# Altium schematic sheet Sheet1.SchDoc
size 1651 x 1651 mm
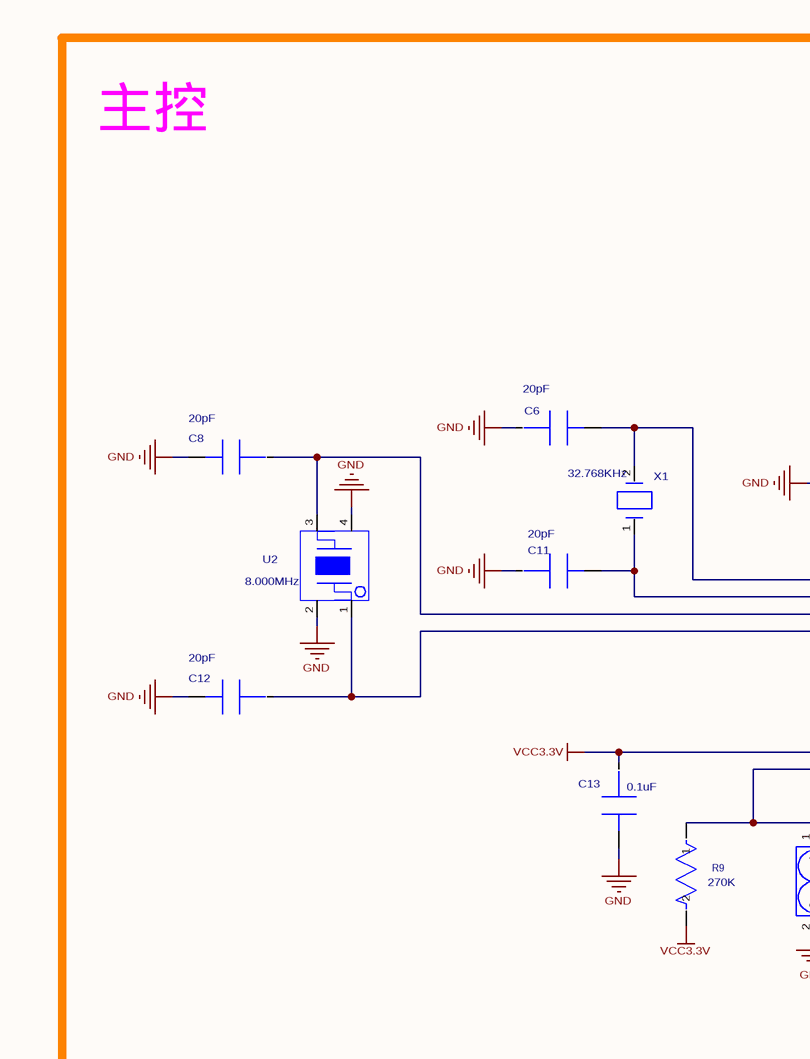
[diagram p0: Sheet1.SchDoc, top column 1 of 4]
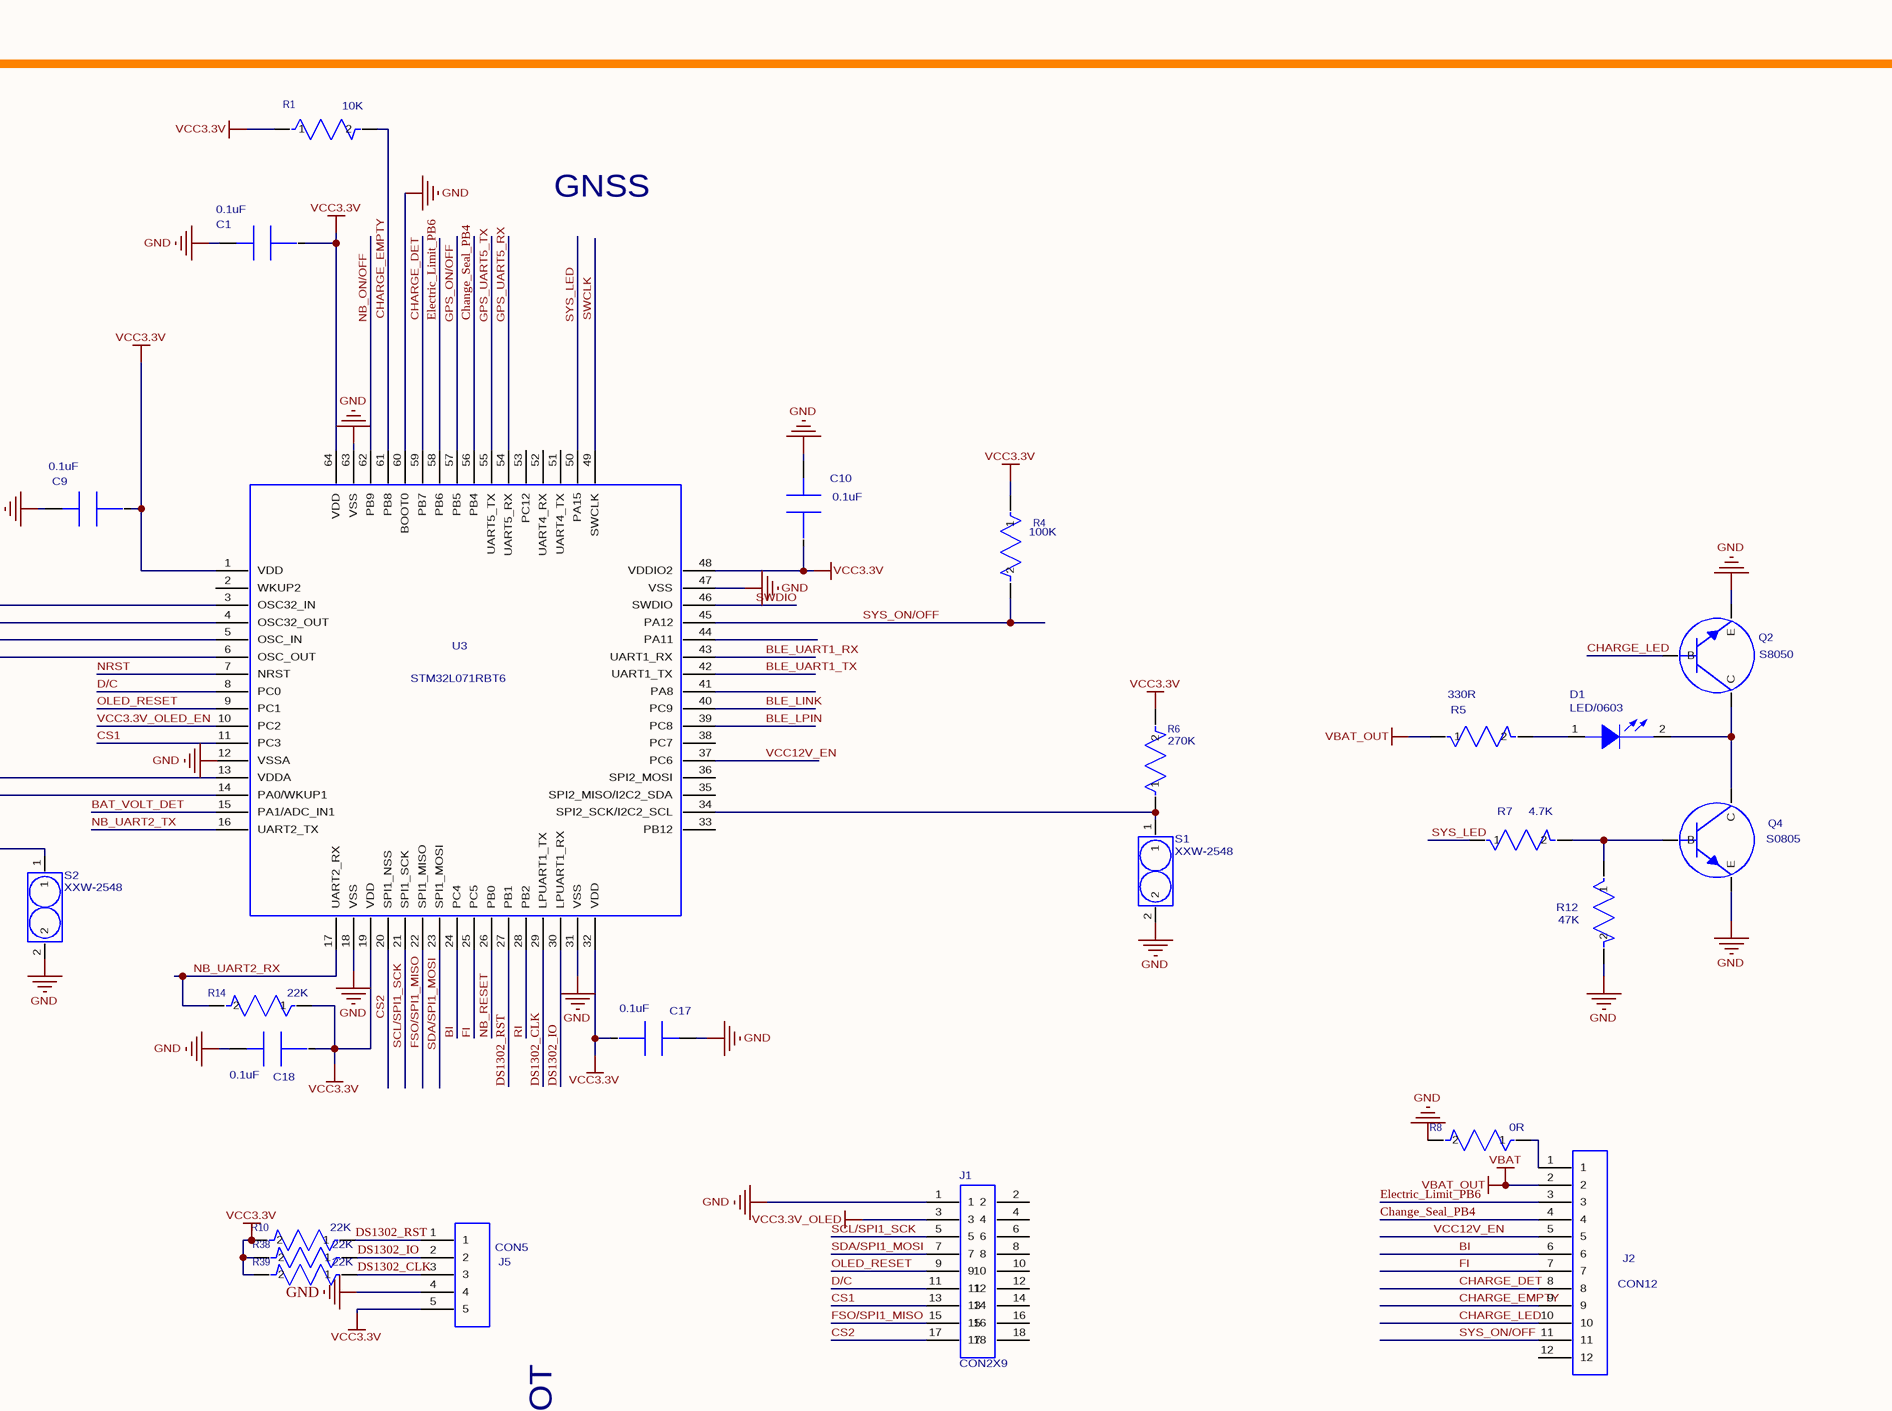
[diagram p1: Sheet1.SchDoc, top column 2 of 4]
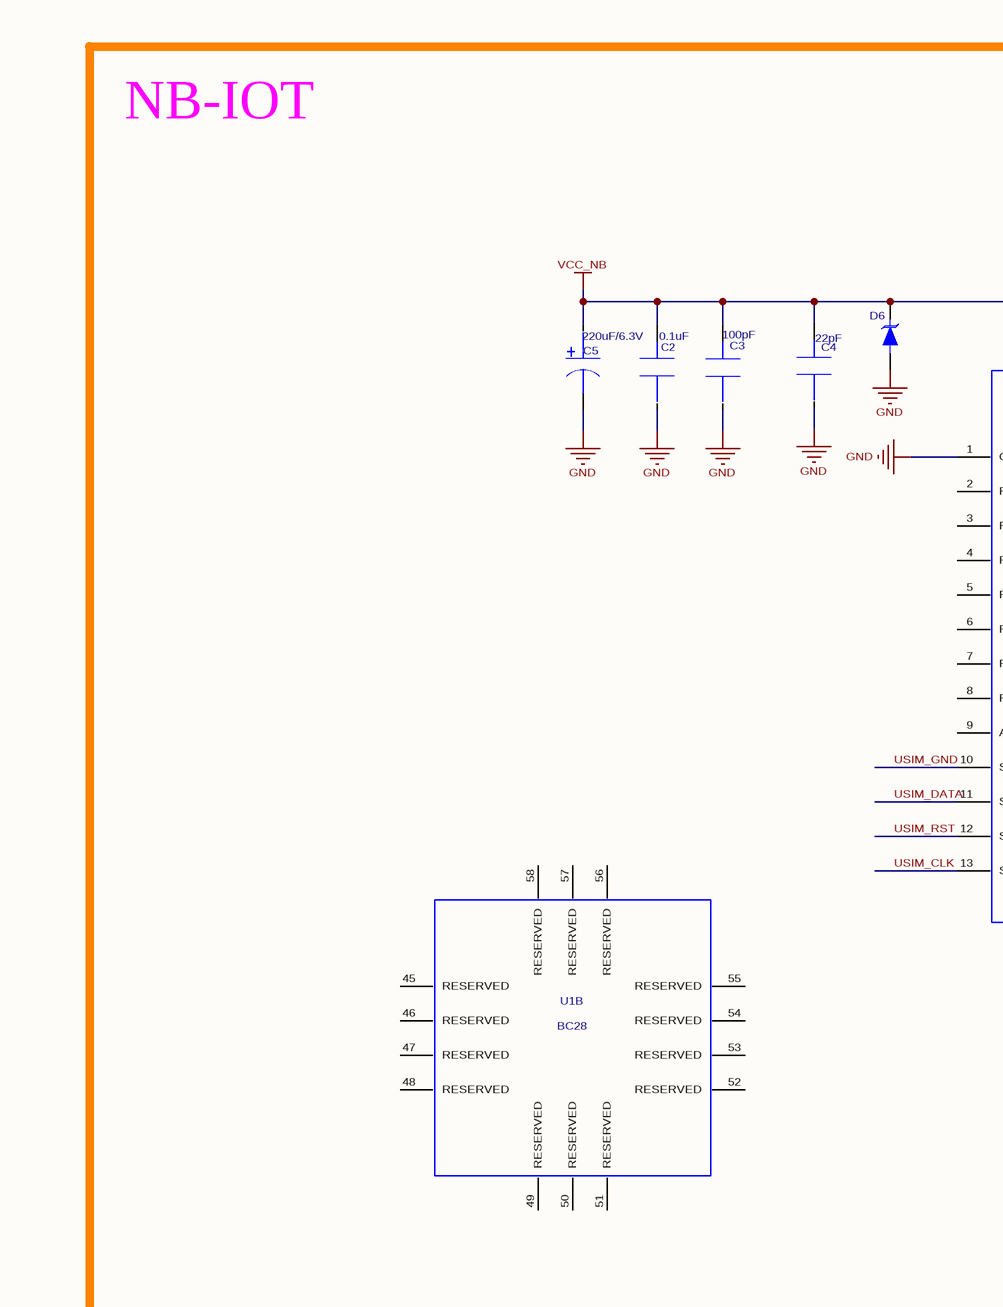
[diagram p2: Sheet1.SchDoc, top column 3 of 4]
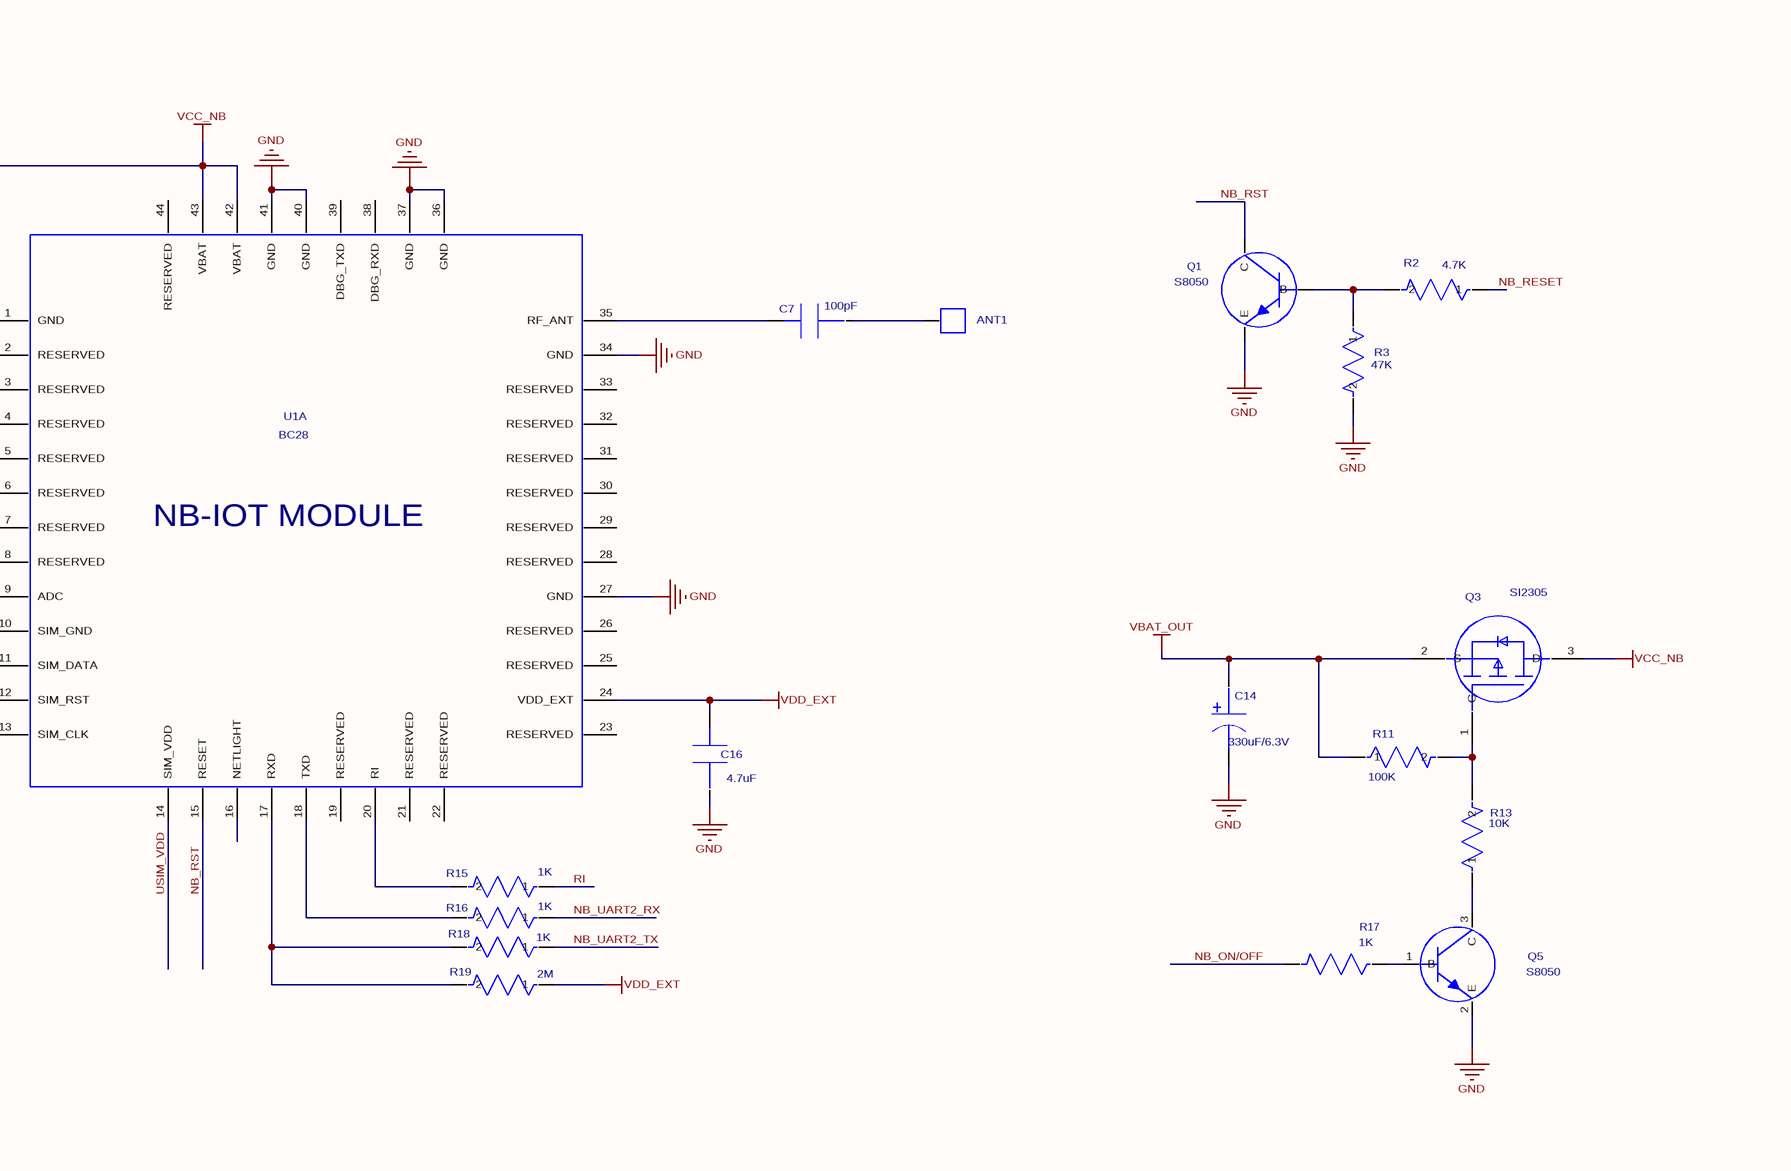
[diagram p3: Sheet1.SchDoc, top column 4 of 4]
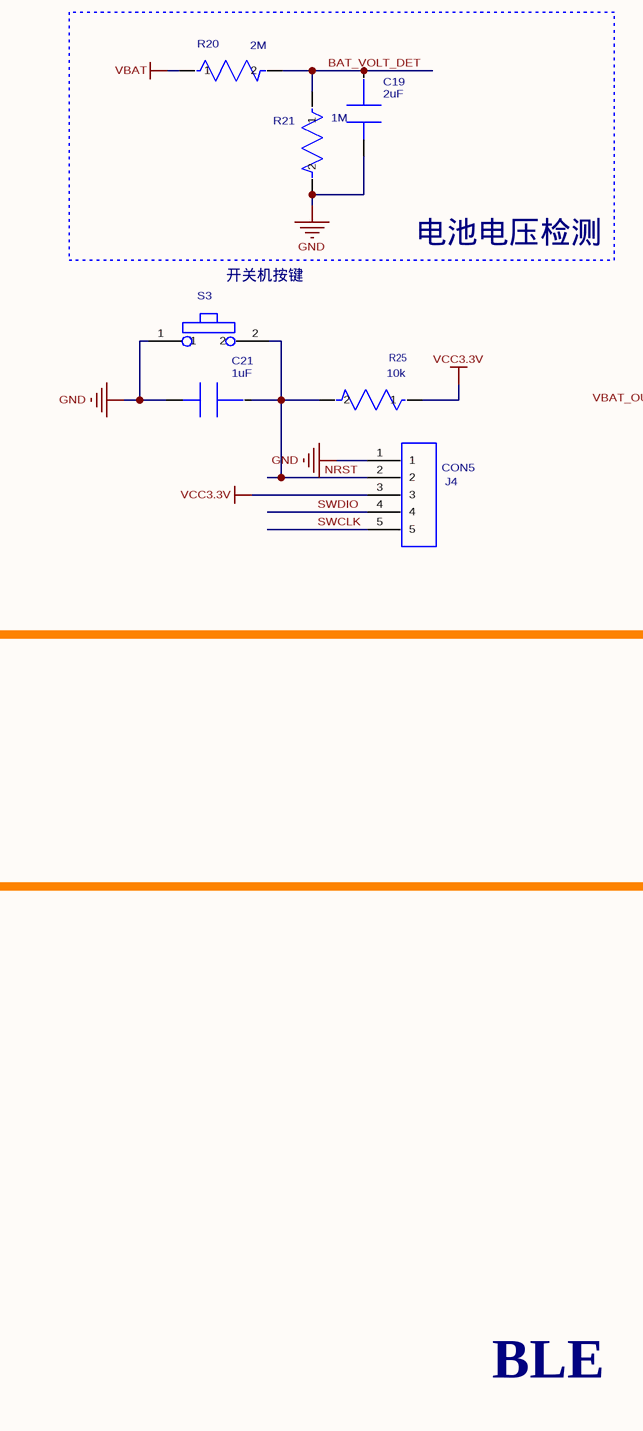
[diagram p4: Sheet1.SchDoc, centre column 1 of 4]
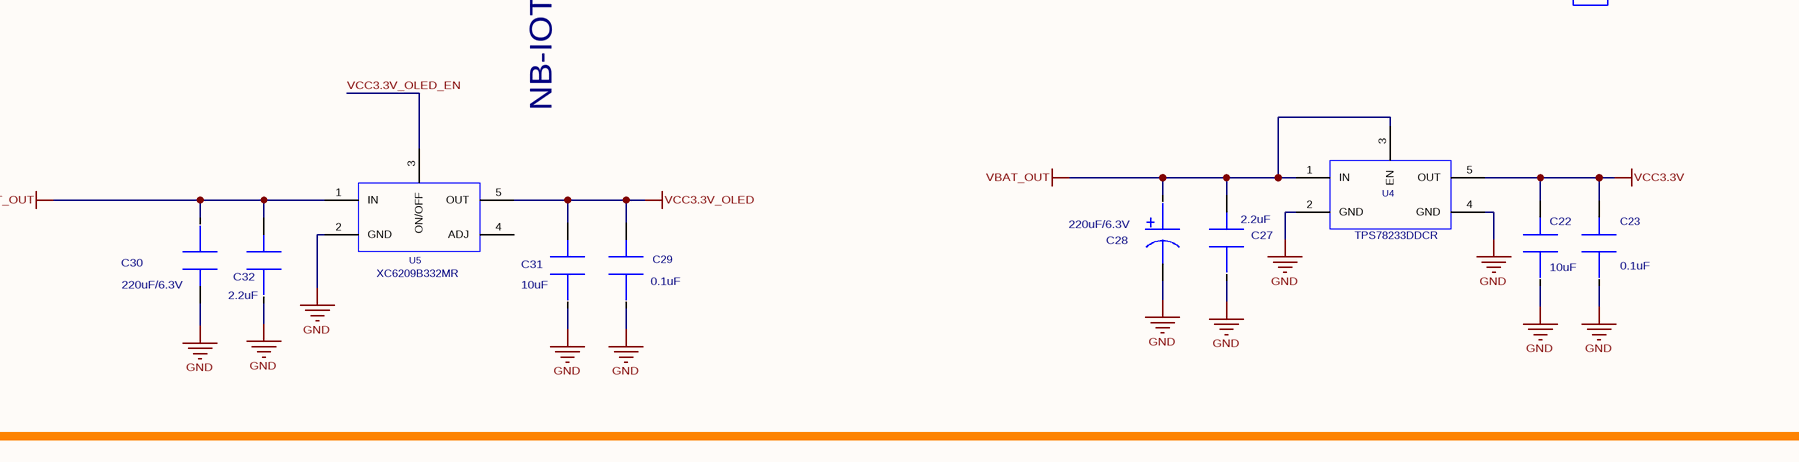
[diagram p5: Sheet1.SchDoc, centre column 2 of 4]
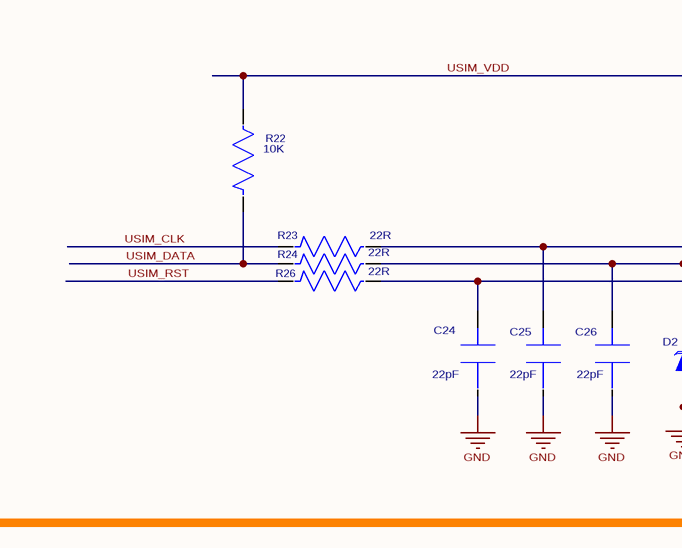
[diagram p6: Sheet1.SchDoc, centre column 3 of 4]
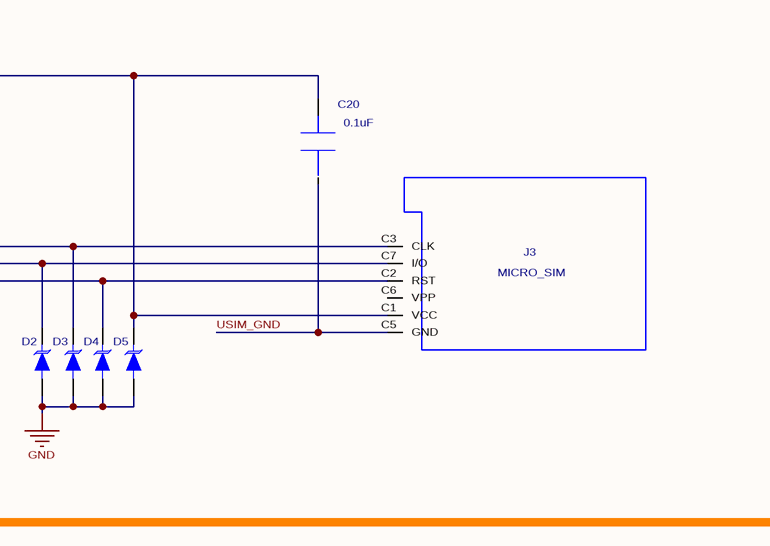
[diagram p7: Sheet1.SchDoc, centre column 4 of 4]
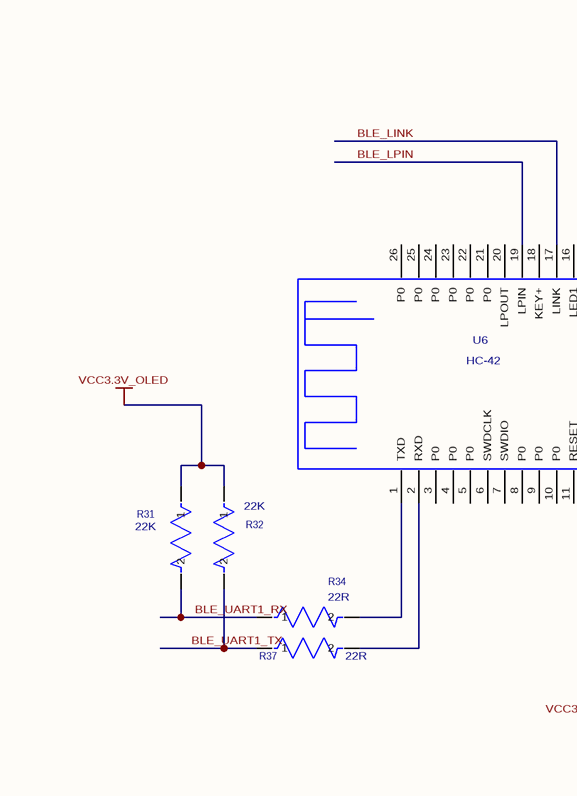
[diagram p8: Sheet1.SchDoc, bottom column 1 of 4]
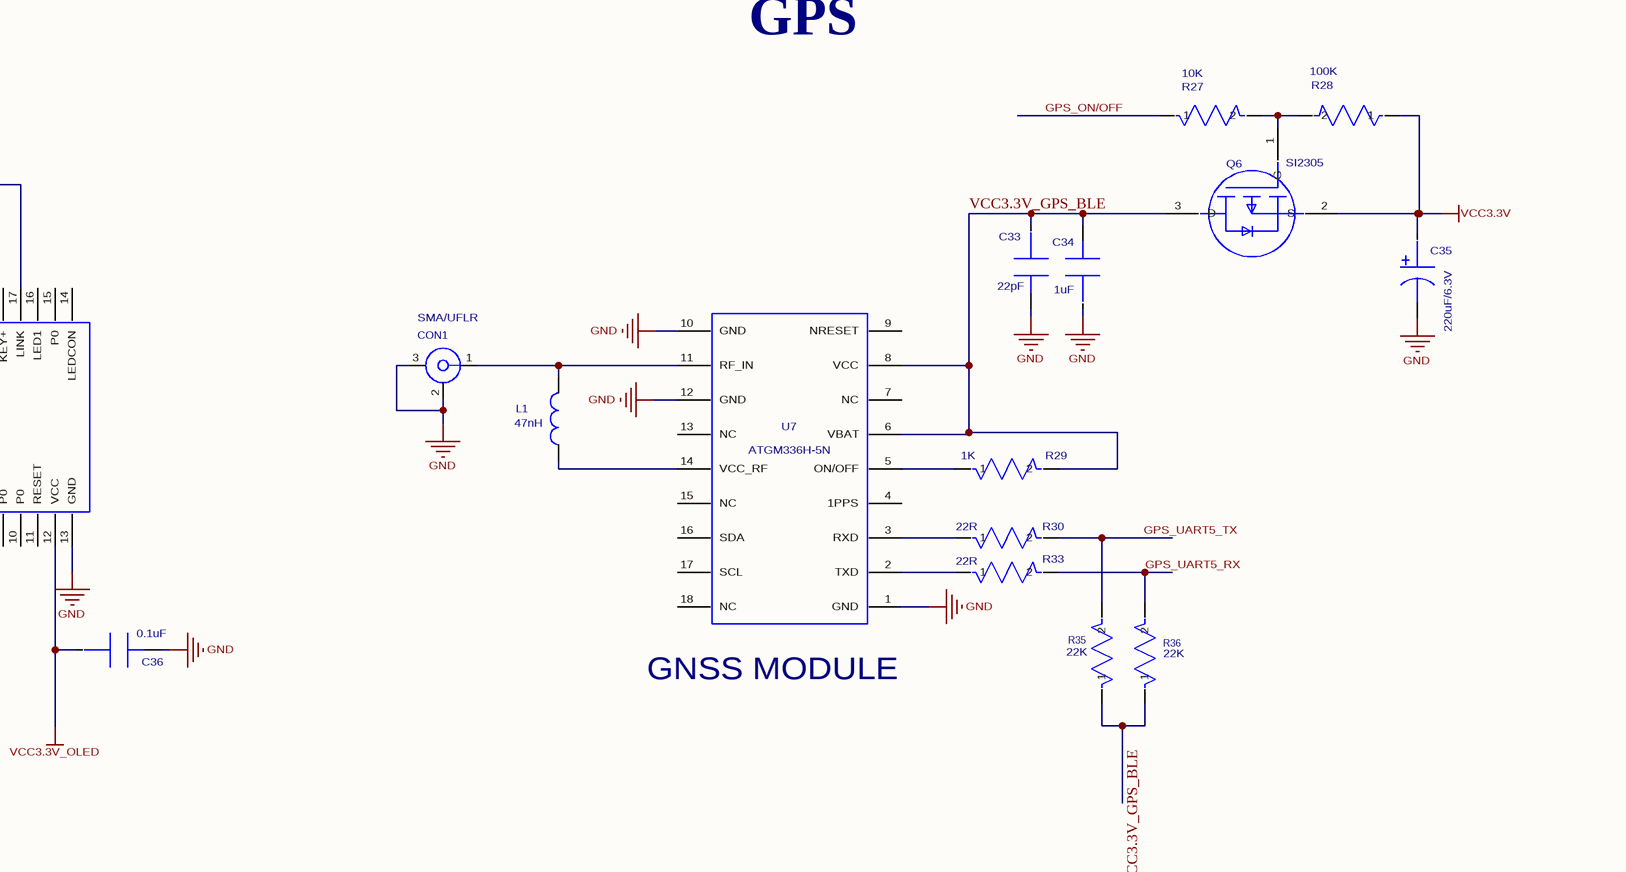
[diagram p9: Sheet1.SchDoc, bottom column 2 of 4]

## Parts
ANT1  PAD  [L4G3210]  (value not drawn)
C1  0.1uF  [C0402]
C2  0.1uF  [C0402]
C3  100pF  [C0402]
C4  22pF  [C0402]
C5  220uF/6.3V  [C1210-E]
C6  20pF  [C0402]
C7  100pF  [C0402]
C8  20pF  [C0402]
C9  0.1uF  [C0402]
C10  0.1uF  [C0402]
C11  20pF  [C0402]
C12  20pF  [C0402]
C13  0.1uF  [C0402]
C14  330uF/6.3V  [CAP6R3X5R6-SM]
C16  4.7uF  [C0603]
C17  0.1uF  [C0402]
C18  0.1uF  [C0402]
C19  2uF  [C0402]
C20  0.1uF  [C0402]
C21  1uF  [C0402]
C22  10uF  [C0603]
C23  0.1uF  [C0402]
C24  22pF  [C0402]
C25  22pF  [C0402]
C26  22pF  [C0402]
C27  2.2uF  [C0603]
C28  220uF/6.3V  [C1210-E]
C29  0.1uF  [C0402]
C30  220uF/6.3V  [C1210-E]
C31  10uF  [C0603]
C32  2.2uF  [C0603]
C33  22pF  [C0402]
C34  1uF  [C0402]
C35  220uF/6.3V  [C1210-E]
C36  0.1uF  [C0402]
CON1  SMA/UFLR  [IPX_U.FL]
D1  LED/0603  [D1206]
D2  ESDLC5V0D3  [SOD-323]  (value not drawn)
D3  ESDLC5V0D3  [SOD-323]  (value not drawn)
D4  ESDLC5V0D3  [SOD-323]  (value not drawn)
D5  ESDLC5V0D3  [SOD-323]  (value not drawn)
D6  ESDLC5V0D3  [SOD-323]  (value not drawn)
J1  CON2X9  [OLED_2X9SMT]
J2  CON12  [CON_12WT]
J3  MICRO_SIM  [MICRO_SIM]
J4  CON5  [SIP1X5-2R54]
J5  CON5  [HDR1X5]
L1  47nH  [L0402]
Q1  S8050  [SOT23]
Q2  S8050  [SOT23]
Q3  SI2305  [SOT23]
Q4  S0805  [SOT23]
Q5  S8050  [SOT23]
Q6  SI2305  [SOT23]
R1  10K  [R0402]
R2  4.7K  [R0402]
R3  47K  [R0402]
R4  100K  [R0402]
R5  330R  [R0402]
R6  270K  [R0402]
R7  4.7K  [R0402]
R8  0R  [R0603]
R9  270K  [R0402]
R10  22K  [R0402]
R11  100K  [R0402]
R12  47K  [R0402]
R13  10K  [R0402]
R14  22K  [R0402]
R15  1K  [R0402]
R16  1K  [R0402]
R17  1K  [R0402]
R18  1K  [R0402]
R19  2M  [R0402]
R20  2M  [R0402]
R21  1M  [R0402]
R22  10K  [R0402]
R23  22R  [R0402]
R24  22R  [R0402]
R25  10k  [R0402]
R26  22R  [R0402]
R27  10K  [R0402]
R28  100K  [R0402]
R29  1K  [R0402]
R30  22R  [R0402]
R31  22K  [R0402]
R32  22K  [R0402]
R33  22R  [R0402]
R34  22R  [R0402]
R35  22K  [R0402]
R36  22K  [R0402]
R37  22R  [R0402]
R38  22K  [R0402]
R39  22K  [R0402]
S1  XXW-2548  [XXW-2548]
S2  XXW-2548  [XXW-2548]
S3  SW_3X6X5  [SW3X6X3R5]  (value not drawn)
U1  BC28  [BC28]  (parts A,B of 2)
U2  8.000MHz  [XTAL4-5X3R2]
U3  STM32L071RBT6  [QFP64-0R5]
U4  TPS78233DDCR  [SOT23-5]
U5  XC6209B332MR  [SOT23-5]
U6  HC-42  [BLEMODE]
U7  ATGM336H-5N  [ATGM336]
X1  32.768KHz  [X_MC146]

## Blocks framed on the sheet
主控: C1 C6 C8-C13 C17 C18 C21-C23 C27-C32 D1 J1 J2 J4 J5 Q2 Q4 R1 R4-R10 R12 R14 R25 R38 R39 S1-S3 U2-U5 X1
NB-IOT: ANT1 C2-C5 C7 C14 C16 C20 C24-C26 D2-D6 J3 Q1 Q3 Q5 R2 R3 R11 R13 R15-R19 R22-R24 R26 U1
电池电压检测: C19 R20 R21

## Nets
GND: C1.2 C2.1 C3.1 C4.1 C5.2 C6.1 C8.2 C9.2 C10.2 C11.1 C12.2 C13.2 C14.2 C16.1 C17.2 C18.2 C19.2 C21.2 C22.1 C23.1 C24.1 C25.1 C26.1 C27.1 C28.2 C29.1 C30.2 C31.1 C32.1 C33.2 C34.1 C35.2 C36.2 CON1.2 CON1.3(GNDA) D2.1(ANODE) D3.1(ANODE) D4.1(ANODE) D5.1(ANODE) D6.1(ANODE) J1.1 J4.1 J5.4 Q1.2(E) Q2.2(E) Q4.2(E) Q5.2(E) R3.2 R8.2 R12.2 R21.2 S1.2 S2.2 S3.1 U1.1(GND) U1.27(GND) U1.34(GND) U1.36(GND) U1.37(GND) U1.40(GND) U1.41(GND) U2.2(NC) U2.4(NC) U3.12(VSSA) U3.18(VSS) U3.31(VSS) U3.47(VSS) U3.60(BOOT0) U3.63(VSS) U4.2(GND) U4.4(GND) U5.2(GND) U6.13(GND) U7.1(GND) U7.10(GND) U7.12(GND)
VBAT: C14.1 C27.2 C28.1 C30.1 C32.2 J2.2 Q3.2(S) R5.1 R11.1 R20.1 U4.1(IN) U4.3(EN) U5.1(IN)  [also labelled VBAT_OUT]
VCC3.3V: C1.1 C9.1 C10.1 C13.1 C17.1 C18.1 C22.2 C23.2 C35.1 J4.3 J5.5 Q6.2(S) R1.1 R4.1 R6.2 R9.2 R10.2 R14.1 R25.1 R28.1 R38.2 R39.2 U3.1(VDD) U3.13(VDDA) U3.19(VDD) U3.32(VDD) U3.48(VDDIO2) U3.64(VDD) U4.5(OUT)
VCC3.3V_OLED: C29.2 C31.2 C36.1 J1.3 R31.1 R32.1 U5.5(OUT) U6.12(VCC)
VCC_NB: C2.2 C3.2 C4.2 C5.1 D6.2(CATHODE) Q3.3(D) U1.42(VBAT) U1.43(VBAT)
VDD_EXT: C16.2 R19.1 U1.24(VDD_EXT)
BAT_VOLT_DET: C19.1 R20.2 R21.1 U3.15(PA1/ADC_IN1)
BI: J2.6 U3.24(PC4)
BLE_LINK: U3.40(PC9) U6.17(LINK)
BLE_LPIN: U3.39(PC8) U6.19(LPIN)
BLE_UART1_RX: R31.2 R34.1 U3.43(UART1_RX)
BLE_UART1_TX: R32.2 R37.1 U3.42(UART1_TX)
Change_Seal_PB4: J2.4 U3.56(PB4)
CHARGE_DET: J2.8 U3.59(PB7)
CHARGE_EMPTY: J2.9 R1.2 U3.61(PB8)
CHARGE_LED: J2.10 Q2.1(B)
CS1: J1.13 U3.11(PC3)
CS2: J1.17 U3.20(SPI1_NSS)
D/C: J1.11 U3.8(PC0)
DS1302_CLK: J5.3 R39.1 U3.29(LPUART1_TX)
DS1302_IO: J5.2 R38.1 U3.30(LPUART1_RX)
DS1302_RST: J5.1 R10.1 U3.27(PB1)
Electric_Limit_PB6: J2.3 U3.58(PB6)
FI: J2.7 U3.25(PC5)
FSO/SPI1_MISO: J1.15 U3.22(SPI1_MISO)
GPS_ON/OFF: R27.1 U3.57(PB5)
GPS_UART5_RX: R33.2 R36.2 U3.54(UART5_RX)
GPS_UART5_TX: R30.2 R35.2 U3.55(UART5_TX)
NB_ON/OFF: R17.2 U3.62(PB9)
NB_RESET: R2.1 U3.26(PB0)
NB_RST: Q1.3(C) U1.15(RESET)
NB_UART2_RX: R14.2 R16.1 U3.17(UART2_RX)
NB_UART2_TX: R18.1 U3.16(UART2_TX)
NRST: C21.1 J4.2 R25.2 S3.2 U3.7(NRST)
OLED_RESET: J1.9 U3.9(PC1)
RI: R15.1 U3.28(PB2)
SCL/SPI1_SCK: J1.5 U3.21(SPI1_SCK)
SDA/SPI1_MOSI: J1.7 U3.23(SPI1_MOSI)
SWCLK: J4.5 U3.49(SWCLK)
SWDIO: J4.4 U3.46(SWDIO)
SYS_LED: R7.1 U3.50(PA15)
SYS_ON/OFF: J2.11 R4.2 U3.45(PA12)
USIM_CLK: R23.2 U1.13(SIM_CLK)
USIM_DATA: R22.2 R24.2 U1.11(SIM_DATA)
USIM_GND: C20.1 J3.C5(GND) U1.10(SIM_GND)
USIM_RST: R26.2 U1.12(SIM_RST)
USIM_VDD: C20.2 D5.2(CATHODE) J3.C1(VCC) R22.1 U1.14(SIM_VDD)
VCC3.3V_GPS_BLE: C33.1 C34.2 Q6.3(D) R29.2 R35.1 R36.1 U7.6(VBAT) U7.8(VCC)
VCC3.3V_OLED_EN: U3.10(PC2) U5.3(ON/OFF)
VCC12V_EN: J2.5 U3.37(PC6)
NetANT1_1: ANT1.1 C7.1
NetC6_2: C6.2 U3.3(OSC32_IN) X1.2
NetC7_2: C7.2 U1.35(RF_ANT)
NetC8_1: C8.1 U2.3(X2) U3.5(OSC_IN)
NetC11_2: C11.2 U3.4(OSC32_OUT) X1.1
NetC12_1: C12.1 U2.1(X1) U3.6(OSC_OUT)
NetC24_2: C24.2 D4.2(CATHODE) J3.C2(RST) R26.1
NetC25_2: C25.2 D3.2(CATHODE) J3.C3(CLK) R23.1
NetC26_2: C26.2 D2.2(CATHODE) J3.C7(I/O) R24.1
NetCON1_1: CON1.1 L1.1 U7.11(RF_IN)
NetD1_1: D1.1(ANODE) R5.2
NetD1_2: D1.2(CATHODE) Q2.3(C) Q4.3(C)
NetJ2_1: J2.1 R8.1
NetL1_2: L1.2 U7.14(VCC_RF)
NetQ1_1: Q1.1(B) R2.2 R3.1
NetQ3_1: Q3.1(G) R11.2 R13.2
NetQ4_1: Q4.1(B) R7.2 R12.1
NetQ5_1: Q5.1(B) R17.1
NetQ5_3: Q5.3(C) R13.1
NetQ6_1: Q6.1(G) R27.2 R28.2
NetR6_1: R6.1 S1.1 U3.34(SPI2_SCK/I2C2_SCL)
NetR9_1: R9.1 S2.1 U3.14(PA0/WKUP1)
NetR15_2: R15.2 U1.20(RI)
NetR16_2: R16.2 U1.18(TXD)
NetR18_2: R18.2 R19.2 U1.17(RXD)
NetR29_1: R29.1 U7.5(ON/OFF)
NetR30_1: R30.1 U7.3(RXD)
NetR33_1: R33.1 U7.2(TXD)
NetR34_2: R34.2 U6.1(TXD)
NetR37_2: R37.2 U6.2(RXD)

Not connected (* = marked no-connect by the designer): J1 2 4 6 8 10 12 14 16 18; J2 12; J3 C6(VPP); U1 2(RESERVED) 3(RESERVED) 4(RESERVED) 5(RESERVED) 6(RESERVED) 7(RESERVED) 8(RESERVED) 9(ADC) 16(NETLIGHT) 19(RESERVED) 21(RESERVED) 22(RESERVED) 23(RESERVED) 25(RESERVED) 26(RESERVED) 28(RESERVED) 29(RESERVED) 30(RESERVED) 31(RESERVED) 32(RESERVED) 33(RESERVED) 38(DBG_RXD) 39(DBG_TXD) 44(RESERVED) 45(RESERVED) 46(RESERVED) 47(RESERVED) 48(RESERVED) 49(RESERVED) 50(RESERVED) 51(RESERVED) 52(RESERVED) 53(RESERVED) 54(RESERVED) 55(RESERVED) 56(RESERVED) 57(RESERVED) 58(RESERVED); U3 2(WKUP2) 33(PB12) 35(SPI2_MISO/I2C2_SDA) 36(SPI2_MOSI) 38(PC7) 41(PA8) 44(PA11) 51(UART4_TX) 52(UART4_RX) 53(PC12); U5 4(ADJ); U6 3(P0) 4(P0) 5(P0) 6(SWDCLK) 7(SWDIO) 8(P0) 9(P0) 10(P0) 11(RESET) 14(LEDCON) 15(P0) 16(LED1) 18(KEY+) 20(LPOUT) 21(P0) 22(P0) 23(P0) 24(P0) 25(P0) 26(P0); U7 4(1PPS) 7(NC) 9(NRESET) 13(NC) 15(NC) 16(SDA) 17(SCL) 18(NC)

## Notes on the sheet
- GNSS
- (near U1) NB-IOT MODULE
- NB-IOT
- 开关机按键
- BLE
- GPS
- (near U7) GNSS MODULE

## Library data of the parts
ANT1 = PAD: Value: 陶瓷天线; PCB DECAL: PF-L4G3210
C1-C14 C16-C36 = C
  C1-C4 C6-C13 C17-C21 C23-C26 C29 C33 C34 C36: PCB DECAL: C0402
  C5 C30 C35: PCB DECAL: C1210-E
  C14: PCB DECAL: CAP6R3X5R6-SM
  C16 C27 C31 C32: PCB DECAL: C0603
  C22: Value: 10uF; PCB DECAL: C0603
  C28: Value: 220uF/6.3V; PCB DECAL: C1210-E
CON1 = SMA/UFLR: Source_Path: D:\SCH\ORCAD\DANIEL\CONNECT.OLB; PCB DECAL: IPX_U.FL
D1 = LED/0603: Source_Path: C:\SCH\ORCAD\DANIEL\KANG-LIB1.OLB; Value: 冰蓝色LED; PCB DECAL: D1206
D2-D6 = TVS_0: TVS  Vrwm=5V Vc=9.8V 2P SOD323 SMT; Part_Number: DLPRO000024; Part_Type: Protection; Manufacture: Micro Commercial Components (MCC); Operating_Temp: -55 to +150; Characteristic: 5V; Source_Path: E:\ORCAD_DATABASE\SYMBOLS\PROTECTION.OLB; Value: ESDLC5V0D3B-TP; CLASS: DISCRETE; PCB DECAL: SOD-323; Datasheet: ESDLC3V3D3-ESDLC12VD3(SOD-323)-49657.pdf; Package: SOD323; Manufacture_Part_Number: ESDLC5V0D3; Value_D: ESDLC5V0D3
J1 = CON2X9: PCB DECAL: OLED2X9SMT-2R54; Value: con2x9
J2 = CON12: PCB DECAL: CON_12LT; SIGPIN13: GND; Value: con12; SIGPIN14: GND
J3 = MICRO_SIM: SIGPIN1: GND; PCB DECAL: MICRO_SIM; SIGPIN2: GND; SIGPIN7: GND; SIGPIN8: GND
J5 = CON5: PCB DECAL: SIP1X5-2R54; Value: con5
L1 = L: PCB DECAL: L0402
Q1 Q2 Q4 Q5 = NPN-A: PCB DECAL: SOT23
  Q2: Value: S8050
Q3 Q6 = FDN338P: PCB DECAL: SOT23
R1-R7 R9-R39 = R: PCB DECAL: R0402
  R32: Value: 22K
R8 = R: PCB DECAL: R0402
S3 = SW_3X6X5: SIGPIN3: GND; PCB DECAL: SW3X6X3R5; SIGPIN4: GND
U1 = BC28: Manufacturer: QUECTEL; Part Description: BC28 15.8X17.7mm H2.05mm RO; Geometry.Height: 2.05mm; Value: BC28; PCB DECAL: BC28
U2 = XTAL_3.2X2.5: Source_Path: D:\SCH\ORCAD\DANIEL\KANG-LIB1.OLB; PCB DECAL: XTAL4-5X3R2
U5 = LP2980: PCB DECAL: SOT23-5
X1 = CRYSTAL2: SIGPIN3: GND; PCB DECAL: X_MC146; SIGPIN4: GND
J4 = CON5: Value: con5; PCB DECAL: SIP1X5-2R54
S1 S2 = XXW-2548: PCB DECAL: XXW-2548
  S1: Value: XXW-2548
U3 = STM32L071RBT6: Value: STM32L071RBT6; PCB DECAL: QFP64-0R5
U4 = TPS78233DDCR: Value: TPS78233DDCR; PCB DECAL: SOT23-5
U7 = ATGM336H-5N: Value: ATGM336H-5N; PCB DECAL: ATGM336